# Altium schematic sheet main.SchDoc
size A
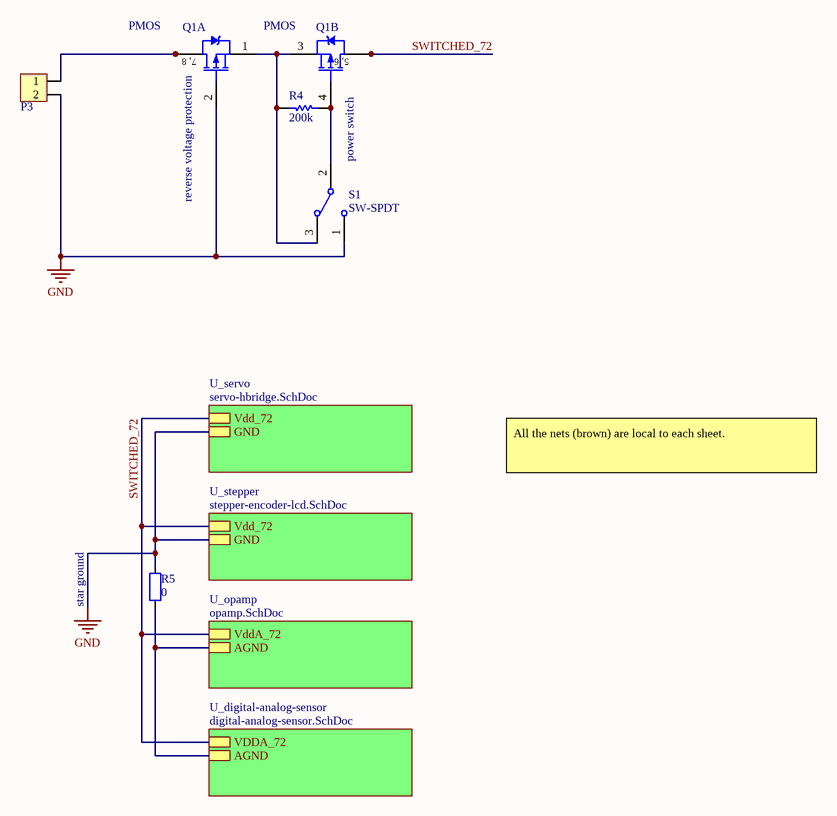
[diagram p0: main.SchDoc]

## Parts
P3  2Way_5  [2Way_5]  (value not drawn)
Q1  PMOS  [SOIC_E200_8]  (parts A,B of 2)
R4  value 200k  [RES_0805]  (hidden comment: Res)
R5  value 0  [RES_0805]  (hidden comment: Res_0805)
S1  SW-SPDT  [G3T-12AH]

## Sub-sheets
U_digital-analog-sensor = digital-analog-sensor.SchDoc: VDDA_72, AGND
U_opamp = opamp.SchDoc: VddA_72, AGND
U_servo = servo-hbridge.SchDoc: Vdd_72, GND
U_stepper = stepper-encoder-lcd.SchDoc: Vdd_72, GND

## Nets
GND: P3.2 Q1.2(G) R5.2 S1.1 ; sheet U_servo/GND, sheet U_stepper/GND
SWITCHED_72: Q1.5(D) Q1.6(D) ; sheet U_digital-analog-sensor/VDDA_72, sheet U_servo/Vdd_72, sheet U_stepper/Vdd_72, sheet U_opamp/VddA_72
NetP3_1: P3.1 Q1.7(D) Q1.8(D)
NetQ1_1: Q1.1(S) Q1.3(S) R4.1 S1.3
NetQ1_4: Q1.4(G) R4.2 S1.2
NetR5_1: R5.1 ; sheet U_digital-analog-sensor/AGND, sheet U_opamp/AGND

## Notes on the sheet
- (near Q1) reverse voltage protection
- (near Q1) power switch
- All the nets (brown) are local to each sheet.
- star ground
- (in symbol IRF7316, part A) 7, 8
- (in symbol IRF7316, part B) 5, 6

## Library data of the parts
P3 = 2Way_5: DB
Q1 = IRF7316: Dual PMOS; Published: 8-Jun-2000; LatestRevisionDate: 13-Apr-2006; LatestRevisionNote: IPC-7351 Footprint Added.; DatasheetVersion: Aug-1997; PackageVersion: Feb-2001; PackageReference: SO-8; Publisher: Altium Limited; PackageDescription: 8-Pin Plastic Small Outline Integrated Circuit 1.27 mm Pitch; Code_JEDEC: MS-012-AA; Code_IPC: SOIC127P600-8; ComponentLink1Description: Manufacturer Link; ComponentLink1URL: http://www.irf.com/; ComponentLink2Description: Datasheet; ComponentLink2URL: http://www.irf.com/product-info/datasheets/data/irf7316.pdf
R4 = Res1: Resistor; Published: 8-Jun-2000; LatestRevisionDate: 17-Jul-2002; LatestRevisionNote: Re-released for DXP Platform.; PackageReference: AXIAL-0.3; Publisher: Altium Limited
R5 = Res_0805: Resistor
S1 = SW-SPDT: SPDT Subminiature Toggle Switch, Right Angle Mounting, Vertical Actuation; Published: 24-Mar-1999; LatestRevisionDate: 17-Dec-2003; LatestRevisionNote: Schematic revised, PCB Footprint replaced.; DatasheetVersion: 05-Dec-2000; PackageReference: TL36WW15050; Publisher: Altium Limited; PackageDescription: Switch; 4 Leads; ComponentLink1Description: Manufacturer Link; ComponentLink1URL: http://www.apem.com